# EasyEDA Pro project 2.8_pcb_src.eprj, board PCB4
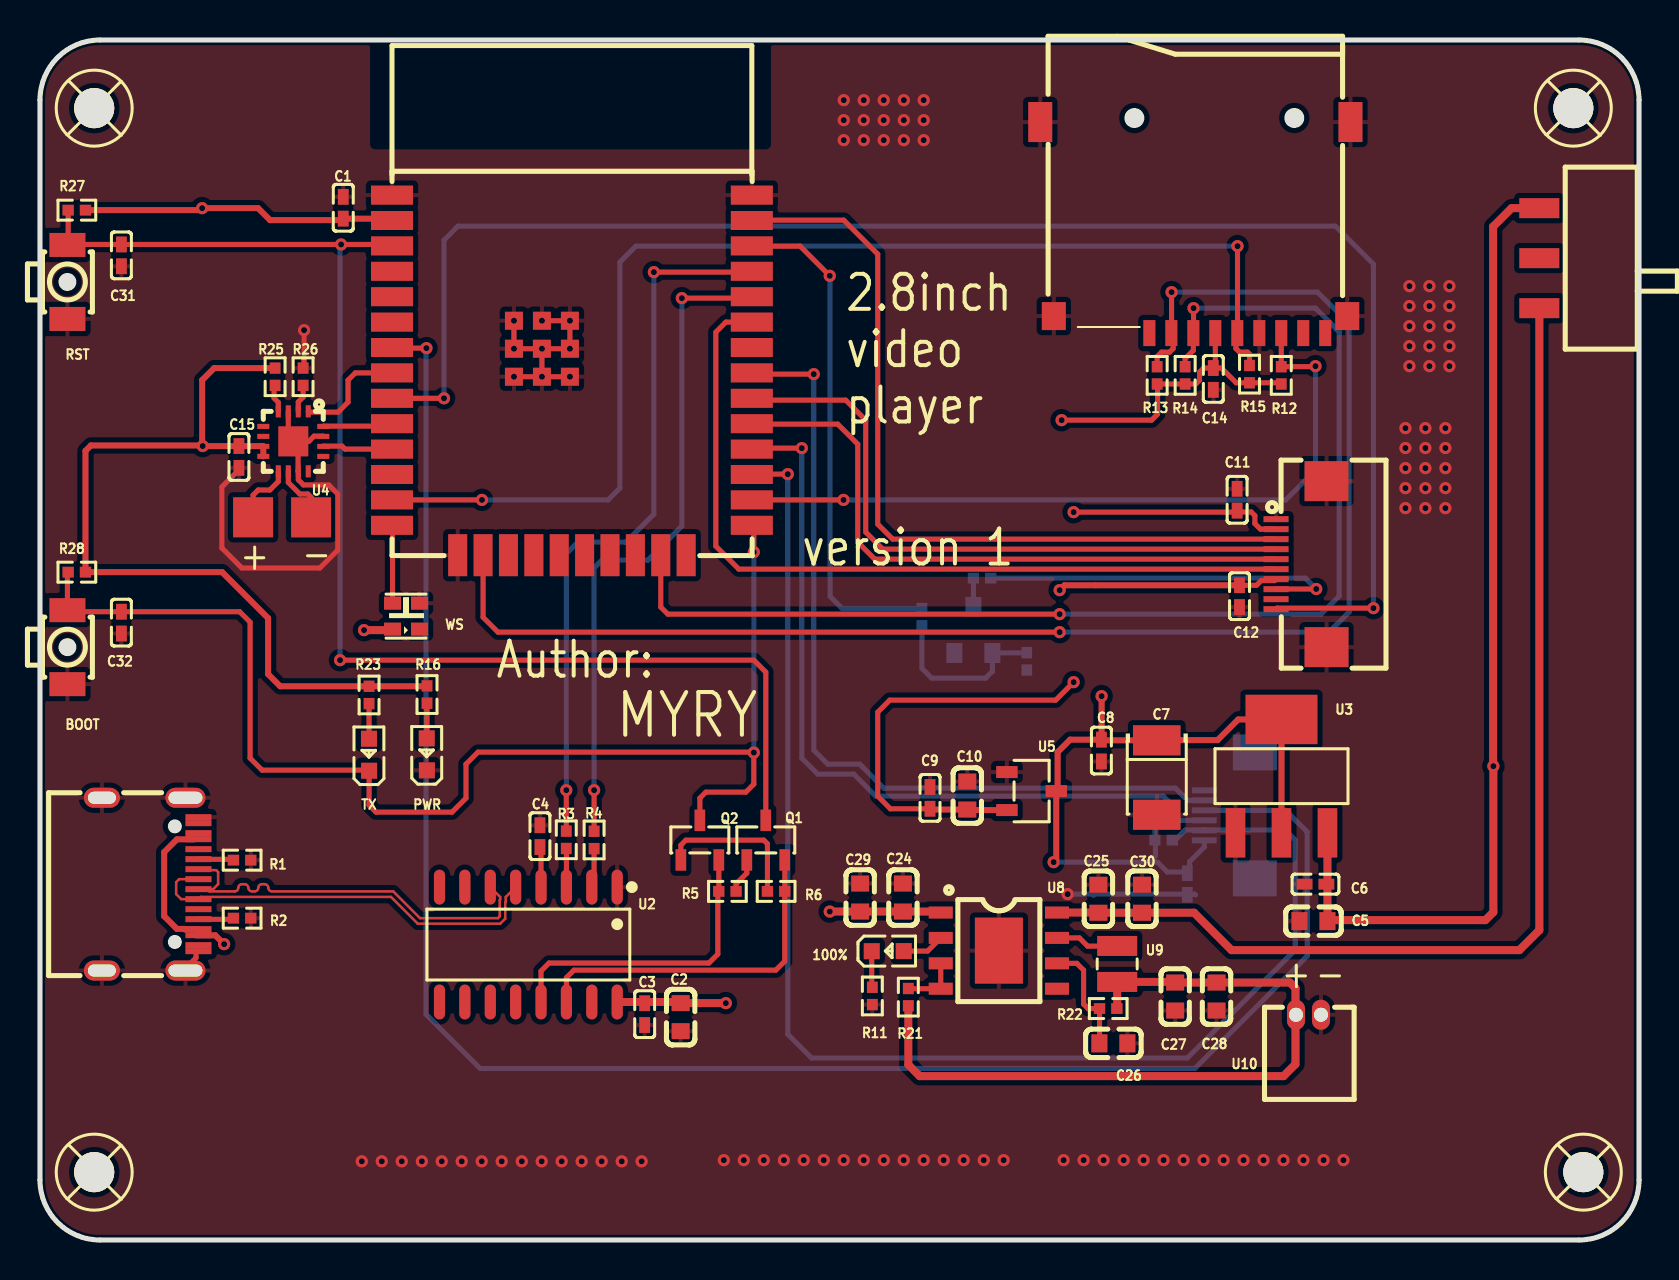
[diagram p4: board, top side]
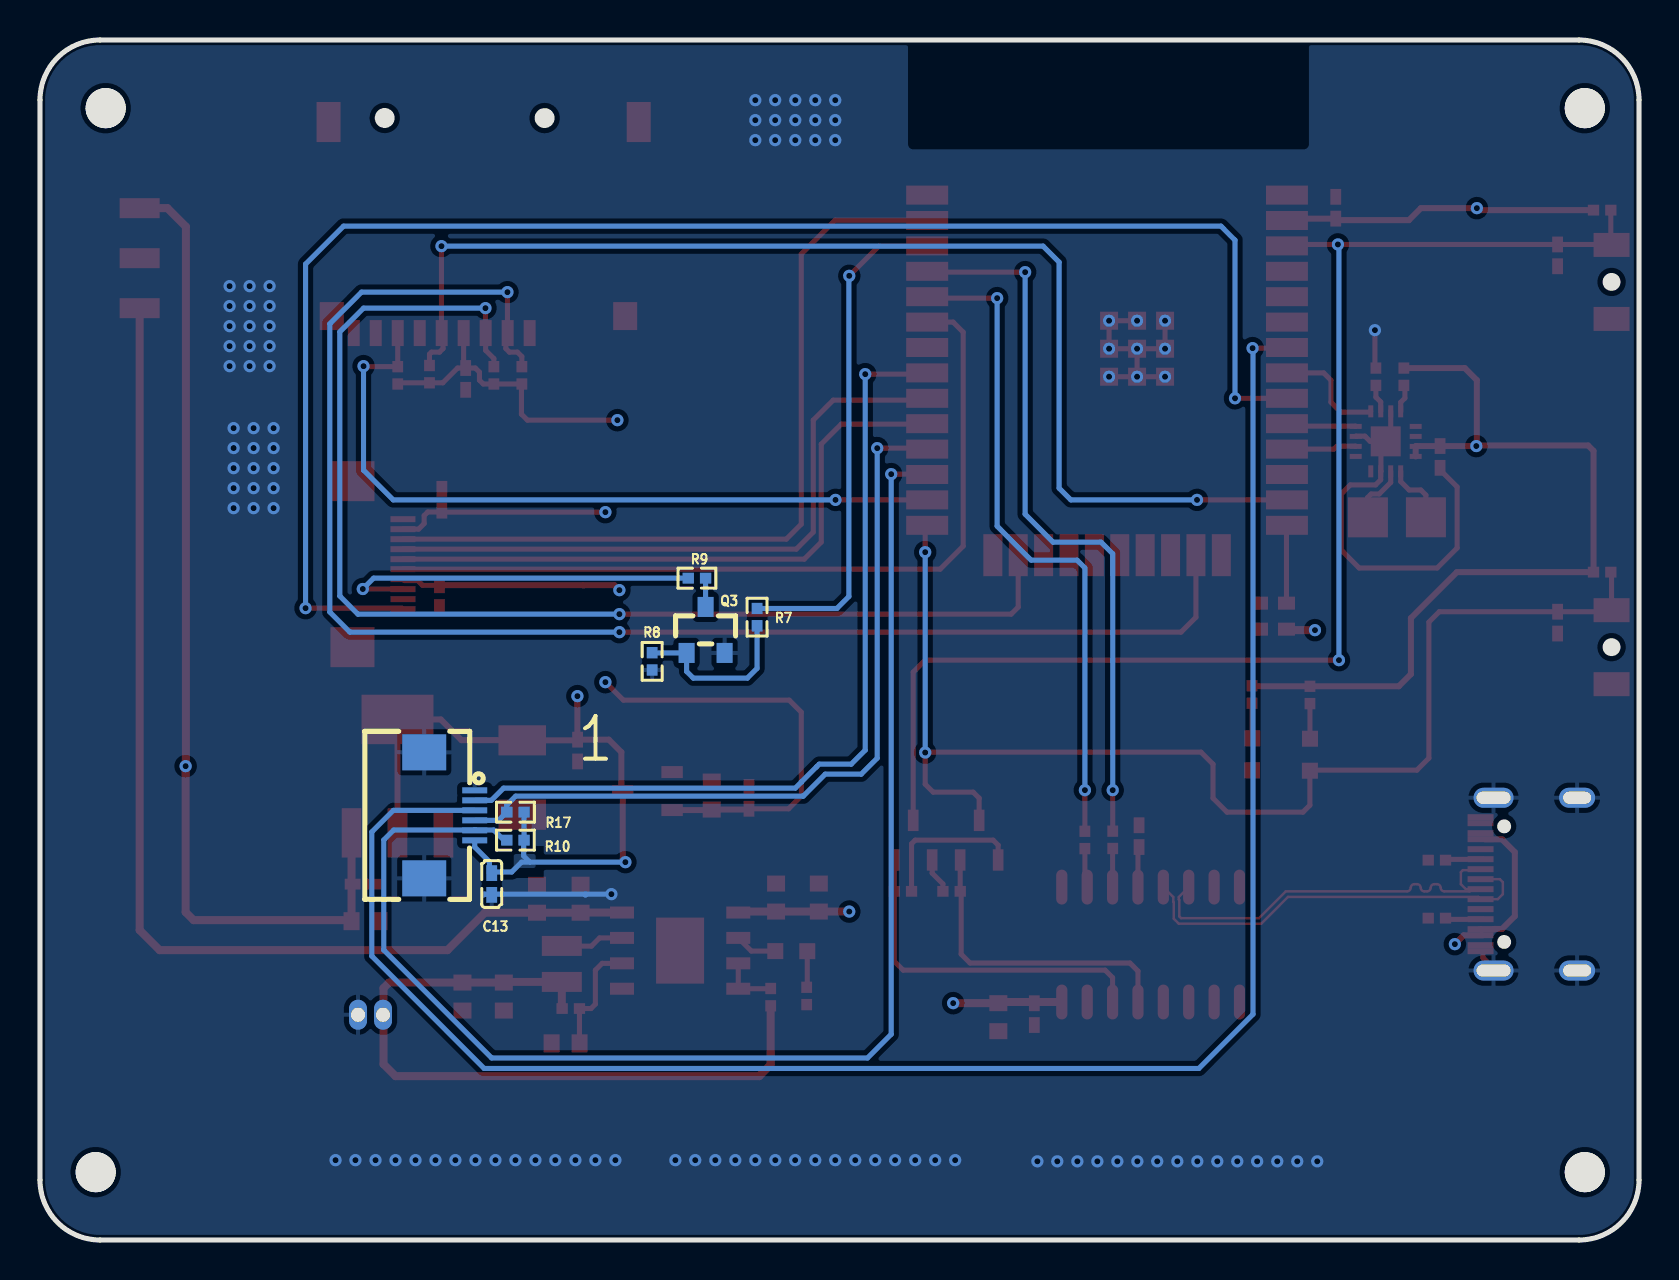
[diagram p5: board, bottom side, seen from below]

Outline 80 x 60 mm; copper layers: Top Layer, GND, PWR, Bottom Layer. Coordinates in mm from the lower left corner of the outline.
Outline path: 0,57 0,3 arc(0.88,0.88) 3,0 77,0 arc(79.12,0.88) 80,3 80,57 arc(79.12,59.12) 77,60 3,60 arc(0.88,59.12) 0,57
Stack: Top Layer 0.035mm 外层铜厚1oz / Dielectric1 0.2104mm 7628 RC49% 8.6mil / GND 0.0152mm 内层铜厚 / Dielectric2 1.065mm 1.1mm H/HOZ Copper / PWR 0.0152mm 内层铜厚 / Dielectric3 0.2104mm 7628 RC49% 8.6mil / Bottom Layer 0.035mm 外层铜厚1oz

## Design rules (mm)
net USB_DP: DP1
net USB_DN: DP1
template: 自定义配置
spacing copperThickness1oz (default): track to track 0.102, other pairs 0.152 to 0.3
spacing copperThickness2oz: track to track 0.203, other pairs 0.152 to 0.3
track width copperThickness1oz (default): min 0.127, default 0.254, max 2.54
track width copperThickness2oz: min 0.203, default 0.254, max 2.54
differential pair differentialPair (default): width min 0.124, default 0.254, max 2.54; gap min 0.152, default 0.152
via viaSize (default): diameter min 0.5, default 0.61, max 10; hole min 0.3, default 0.305, max 6.3

## Placement (name value [footprint] x y rotation side)
100%  XL-1608SURC-06  [LED0603-RD_RED]  42.41 14.44 0 top
BOOT  TS-1063S-B3D4  [KEY-SMD_L3.0-W2.5-LS4.0_TS-1603S]  1.37 29.64 270 top
C1  100nF  [C0402]  15.17 51.61 270 top
C2  10uF  [C0603]  32.05 11.14 90 top
C3  100nF  [C0402]  30.25 11.29 270 top
C4  100nF  [C0402]  25.01 20.19 270 top
C5  10uF  [C0603]  63.71 15.94 0 top
C6  100nF  [C0402]  63.81 17.79 180 top
C7  100uF  [CASE-B_3528]  55.87 23.12 270 top
C8  100nF  [C0402]  53.1 24.47 90 top
C9  100nF  [C0402]  44.53 22.11 270 top
C10  47uF  [C0603]  46.39 22.22 270 top
C11  100nF  [C0402]  59.89 37.01 90 top
C12  100nF  [C0402]  60.01 32.19 270 top
C13  100nF  [C0402]  57.4 17.8 270 bottom
C14  100nF  [C0402]  58.7 43.05 270 top
C15  100nF  [C0402]  9.95 39.15 270 top
C24  10uF  [C0603]  43.17 17.12 90 top
C25  10uF  [C0603]  52.95 17.06 90 top
C26  22uF  [C0603]  53.7 9.83 180 top
C27  22uF  [C0603]  56.79 12.17 270 top
C28  22uF  [C0603]  58.86 12.17 270 top
C29  22uF  [C0603]  41.03 17.12 270 top
C30  22uF  [C0603]  55.13 17.06 270 top
C31  100nF  [C0402]  4.07 49.23 90 top
C32  100nF  [C0402]  4.07 30.87 90 top
CARD1  TF-01A  [TF-SMD_TF-01A]  57.8 50.62 180 top
FPC1  0.5K-DX-10PWBG  [FPC-SMD_10P-P0.50_HDGC_0.5K-DX-10PWBG]  63.1 33.79 90 top
FPC2  0.5K-DX-6PWBG  [FPC-SMD_6P-P0.50_DEALON_0.5K-DX-6PWB]  59.51 21.23 270 bottom
PWR  XL-1608SURC-06  [LED0603-RD_RED]  19.35 24.28 90 top
Q1  S8050  [SOT-23-3_L2.9-W1.3-P1.90-LS2.3-BR]  36.31 19.99 270 top
Q2  S8050  [SOT-23-3_L2.9-W1.3-P1.90-LS2.3-BR]  33.01 19.99 270 top
Q3  Si2302CDS-T1-GE3  [SOT-23_L2.9-W1.3-P1.90-LS2.4-BR]  46.7 30.5 270 bottom
R1  5.1K  [R0402]  10.11 18.99 180 top
R2  5.1K  [R0402]  10.11 16.09 0 top
R3  5.1K  [R0402]  26.33 20.01 90 top
R4  5.1K  [R0402]  27.72 20 90 top
R5  12K  [R0402]  34.39 17.43 0 top
R6  12K  [R0402]  36.83 17.43 180 top
R7  1K  [R0402]  44.12 31.14 270 bottom
R8  10K  [R0402]  49.37 28.93 270 bottom
R9  10  [R0402]  47.13 33.09 0 bottom
R10  4.7K  [R0402]  56.21 19.99 0 bottom
R11  2K  [R0402]  41.64 12.2 90 top
R12  10K  [R0402]  62.1 43.23 270 top
R13  10K  [R0402]  55.89 43.23 270 top
R14  10K  [R0402]  57.29 43.23 270 top
R15  10K  [R0402]  60.51 43.29 270 top
R16  470  [R0402]  19.36 27.27 270 top
R17  4.7K  [R0402]  56.21 21.39 0 bottom
R21  1K  [R0402]  43.44 12.14 90 top
R22  1K  [R0402]  53.44 11.57 0 top
R23  470  [R0402]  16.46 27.25 270 top
R25  1M  [R0402]  11.76 43.16 90 top
R26  220  [R0402]  13.16 43.16 90 top
R27  10K  [R0402]  1.84 51.49 0 top
R28  10K  [R0402]  1.84 33.39 0 top
RST  TS-1063S-B3D4  [KEY-SMD_L3.0-W2.5-LS4.0_TS-1603S]  1.37 47.9 270 top
SCREW1  -  [Screw-Hole-M2]  2.71 56.59 0 top
SCREW2  -  [Screw-Hole-M2]  76.71 56.59 0 top
SCREW3  -  [Screw-Hole-M2]  77.21 3.39 0 top
SCREW4  -  [Screw-Hole-M2]  2.71 3.39 0 top
SW3  SK-3245S-L1-A  [SW-SMD_SK-3245S-L1-A-1]  75.01 49.09 270 top
TP1  -  [Test-Point-0.5mm]  13.56 36.13 180 top
TP2  -  [Test-Point-0.5mm]  10.66 36.14 180 top
TX  XL-1608SURC-06  [LED0603-RD_RED]  16.46 24.26 90 top
U2  CH340C  [SOP-16_L10.0-W3.9-P1.27-LS6.0-BL]  24.43 14.77 180 top
U3  AMS1117-3.3  [SOT-223-4_L6.5-W3.5-P2.30-LS7.0-BR]  62.11 23.19 270 top
U4  MAX98357AETE+T  [TQFN-16_L3.0-W3.0-P0.50-BL-EP1.5]  12.67 39.93 180 top
U5  XC6206-2.8V  [SOT-23-3_L2.9-W1.6-P1.90-LS2.8-BR]  49.61 22.45 180 top
U8  IP5306  [ESOP-8_L4.9-W3.9-P1.27-LS6.0-BL-EP]  47.97 14.47 270 top
U9  1uH  [IND-SMD_L2.5-W2.0_YXNAQ252010-3R3M]  53.89 13.8 90 top
U10  ZX-MX1.25-2PWZ  [CONN-TH_2P-P1.25_ZX-MX1.25-2PWZ]  63.46 11.26 0 top
U11  ESP32-WROOM-32E-N16  [WIFI-SMD_ESP32-WROOM-32E]  26.61 43.24 270 top
USB1  KH-TYPE-C-16P  [USB-C-SMD_KH-TYPE-C-16P]  5.51 17.79 270 top
WS  XL-2020RGBC-WS2812B  [LED-SMD_4P-L2.0-W2.0-BR-1]  18.31 31.19 0 top

## Footprints (pads in the part's own frame, mm; a bottom-side part is the same pattern mirrored in y, then rotated)
C0402
  rect 0.79x0.54 smd: 1(-0.545,0) 2(0.545,0)
C0603
  rect 0.8x0.9 smd: 1(-0.7,0) 2(0.7,0)
CASE-B_3528
  rect 1.506x2.376 smd: 1(-1.861,0) 2(1.861,0)
CONN-TH_2P-P1.25_ZX-MX1.25-2PWZ
  oval 0.9x1.5 hole 0.7: 1(-0.625,0) 2(0.625,0)
ESOP-8_L4.9-W3.9-P1.27-LS6.0-BL-EP
  rect 0.6x1.2 smd: 1(-1.905,-2.909) 2(-0.635,-2.909) 3(0.635,-2.909) 4(1.905,-2.909) 5(1.905,2.909) 6(0.635,2.909) 7(-0.635,2.909) 8(-1.905,2.909)
  rect 3.3x2.4 smd: 9(0,0)
FPC-SMD_6P-P0.50_DEALON_0.5K-DX-6PWB
  rect 0.3x1.25 smd: 1(-1.25,1.262) 2(-0.75,1.262) 3(-0.25,1.262) 4(0.25,1.262) 5(0.75,1.262) 6(1.25,1.262)
  rect 1.8x2.2 smd: 7(3.15,-1.262) 8(-3.15,-1.262)
FPC-SMD_10P-P0.50_HDGC_0.5K-DX-10PWBG
  rect 0.3x1.25 smd: 1(2.25,1.262) 2(1.75,1.262) 3(1.25,1.262) 4(0.75,1.262) 5(0.25,1.262) 6(-0.25,1.262) 7(-0.75,1.262) 8(-1.25,1.262) 9(-1.75,1.262) 10(-2.25,1.262)
  rect 2x2.2 smd: 11(-4.15,-1.262) 12(4.15,-1.262)
IND-SMD_L2.5-W2.0_YXNAQ252010-3R3M
  rect 1x2 smd: 1(0.9,0) 2(-0.9,0)
KEY-SMD_L3.0-W2.5-LS4.0_TS-1603S
  rect 1.2x1.8 smd: 1(-1.85,0) 2(1.85,0)
LED0603-RD_RED
  rect 0.8x0.8 smd: 1(-0.799,-0.004) 2(0.799,0.004)
LED-SMD_4P-L2.0-W2.0-BR-1
  rect 0.85x0.65 smd: 1(0.675,-0.65) 2(0.675,0.65) 3(-0.675,0.65) 4(-0.675,-0.65)
R0402
  rect 0.566x0.54 smd: 1(-0.433,0) 2(0.433,0)
Screw-Hole-M2
  round 2 hole 2: 1(0,0)
SOP-16_L10.0-W3.9-P1.27-LS6.0-BL
  oval 0.56x1.745 smd: 1(-4.445,-2.873) 2(-3.175,-2.873) 3(-1.905,-2.873) 4(-0.635,-2.873) 5(0.635,-2.873) 6(1.905,-2.873) 7(3.175,-2.873) 8(4.445,-2.873) 9(4.445,2.873) 10(3.175,2.873) 11(1.905,2.873) 12(0.635,2.873) 13(-0.635,2.873) 14(-1.905,2.873) 15(-3.175,2.873) 16(-4.445,2.873)
SOT-23-3_L2.9-W1.3-P1.90-LS2.3-BR
  rect 1.07x0.532 smd: 1(0.99,-0.95) 2(0.99,0.95) 3(-0.99,0)
SOT-23-3_L2.9-W1.6-P1.90-LS2.8-BR
  rect 1.07x0.6 smd: 1(1.235,-0.95) 2(1.235,0.95) 3(-1.235,0)
SOT-23_L2.9-W1.3-P1.90-LS2.4-BR
  rect 1x0.8 smd: 1(1.15,-0.95) 2(1.15,0.95) 3(-1.15,0)
SOT-223-4_L6.5-W3.5-P2.30-LS7.0-BR
  rect 2.47x0.98 smd: 1(2.835,-2.3) 2(2.835,0) 3(2.835,2.3)
  rect 2.47x3.6 smd: 4(-2.835,0)
SW-SMD_SK-3245S-L1-A-1
  rect 1x2 smd: 1(-2.5,0) 2(0,0) 3(2.5,0)
Test-Point-0.5mm
  rect 2x2 smd: 1(0,0)
TF-SMD_TF-01A
  rect 0.6x1.3 smd: 1(2.3,5.276) 2(1.2,5.276) 3(0.101,5.276) 4(-1,5.276) 5(-2.099,5.276) 6(-3.2,5.276) 7(-4.3,5.276) 8(-5.399,5.276) 9(-6.5,5.276)
  rect 1.2x1.4 smd: 10(-7.599,4.426) 13(7.08,4.426)
  rect 1.2x2 smd: 11(-7.76,-5.276) 12(7.76,-5.276)
TQFN-16_L3.0-W3.0-P0.50-BL-EP1.5
  rect 0.25x0.6 smd: 1(-0.749,-1.5) 2(-0.248,-1.5) 3(0.252,-1.5) 4(0.751,-1.5) 9(0.75,1.5) 10(0.25,1.5) 11(-0.25,1.5) 12(-0.749,1.5)
  rect 0.6x0.25 smd: 5(1.5,-0.748) 6(1.5,-0.248) 7(1.5,0.252) 8(1.5,0.752) 13(-1.5,0.752) 14(-1.5,0.252) 15(-1.5,-0.248) 16(-1.5,-0.748)
  rect 1.5x1.5 smd: 17(0,0)
USB-C-SMD_KH-TYPE-C-16P
  oval 1x2 hole 0.6x1.7: 1(-4.32,1.765) 2(4.32,1.765)
  oval 1x1.8 hole 0.6x1.4: 3(-4.32,-2.415) 4(4.32,-2.415)
  rect 0.3x1.3 smd: A1(-3.35,2.415) A4(-2.55,2.415) A5(-1.25,2.415) A6(-0.25,2.415) A7(0.25,2.415) A8(1.25,2.415) A9(2.55,2.415) A12(3.35,2.415) B1(3.05,2.415) B4(2.25,2.415) B5(1.75,2.415) B6(0.75,2.415) B7(-0.75,2.415) B8(-1.75,2.415) B9(-2.25,2.415) B12(-3.05,2.415)
WIFI-SMD_ESP32-WROOM-32E
  rect 0.95x2.1 smd: 1(-9.002,-9) 2(-7.732,-9) 3(-6.463,-9) 4(-5.192,-9) 5(-3.922,-9) 6(-2.652,-9) 7(-1.383,-9) 8(-0.113,-9) 9(1.157,-9) 10(2.428,-9) 11(3.697,-9) 12(4.968,-9) 13(6.237,-9) 14(7.508,-9) 25(7.508,9) 26(6.237,9) 27(4.968,9) 28(3.697,9) 29(2.428,9) 30(1.157,9) 31(-0.113,9) 32(-1.383,9) 33(-2.652,9) 34(-3.922,9) 35(-5.192,9) 36(-6.463,9) 37(-7.732,9) 38(-9.002,9)
  rect 2.1x0.95 smd: 15(9.002,-5.715) 16(9.002,-4.445) 17(9.002,-3.175) 18(9.002,-1.905) 19(9.002,-0.635) 20(9.002,0.635) 21(9.002,1.905) 22(9.002,3.175) 23(9.002,4.445) 24(9.002,5.715)
  rect 0.9x0.9 smd: 39(-2.721,-0.1) 39(-2.721,-1.5) 39(-2.721,-2.9) 39(-1.321,-0.1) 39(-1.321,-1.5) 39(-1.321,-2.9) 39(0.079,-0.1) 39(0.079,-1.5) 39(0.079,-2.9)

## Nets
As in the schematic, except:
5V: C2.2 C3.1 C5.2 C6.1 SW3.1 U2.16 U3.3 WS.4
GND: BOOT.2 C1.1 C2.1 C3.2 C4.1 C5.1 C6.2 C7.2 C8.1 C9.1 C10.1 C11.2 C12.2 C13.2 C14.2 C15.2 C24.2 C25.2 C26.1 C27.2 C28.2 C29.1 C30.1 C31.1 C32.1 CARD1.6 CARD1.10 CARD1.11 CARD1.12 CARD1.13 FPC1.1 FPC1.11 FPC1.12 FPC2.1 FPC2.7 FPC2.8 PWR.1 Q3.2 R1.1 R2.2 R8.2 R11.1 R26.2 RST.2 U2.1 U3.1 U4.3 U4.11 U4.15 U4.17 U5.1 U8.9 U10.2 U11.1 U11.15 U11.38 U11.39 USB1.1 USB1.2 USB1.3 USB1.4 USB1.A1 USB1.A12 USB1.B1 USB1.B12 WS.2
EN: C31.2 Q1.3 R27.1 RST.1 U11.3
IO0: BOOT.1 C32.2 Q2.3 R28.1 TX.1 U11.25
IO12_WS: U11.14 WS.3
$1N3729: 100%.2 U8.2
$1N3730: 100%.1 R11.2
$1N3861: R23.2 TX.2
$1N3865: PWR.2 R16.2

Pads without a net: CARD1 1 8 9; FPC1 9; SCREW1 1; SCREW2 1; SCREW3 1; SCREW4 1; SW3 2; U2 7 8 9 10 11 12 15; U4 5 6 12 13; U8 5; U11 4 5 6 12 17 18 19 20 21 22 24 32; USB1 A8 B8; WS 1

## Via types
v1: diameter 0.61, hole 0.305, Top Layer to Bottom Layer, 138 vias

## Routing (per net, layer and track width the routed paths; a pad name or vN(x,y) marks a point on that pad's centre or on a via; arc(x,y) is an arc through that point)
2.8V: length 40.6
  Top Layer w0.254: C9.2 42.55,21.56 41.91,22.19 41.91,26.39 42.51,26.99 50.81,26.99 v1(51.71,27.89) ; v1(51.71,36.39) 59.82,36.39 C11.1 59.96,36.4 60.6,36.4 60.78,36.22 60.78,35.82 61.06,35.54 FPC1.2
  Top Layer w0.3: C9.2 44.57,21.52 C10.2 46.42,21.5 U5.2
  PWR w0.254: v1(51.71,27.89) v1(51.71,36.39)
3V3: length 203.7
  Top Layer w0.254: C14.1 58.8,43.7 CARD1.4 ; C14.1 58.22,43.6 58.01,43.39 58.01,42.99 57.82,42.8 R14.2 R13.2 55.91,42.78 55.91,41.29 55.61,40.99 v1(51.11,40.99) ; C14.1 59.11,43.6 59.85,42.86 R15.2 62.04,42.86 R12.2 ; C12.1 60.87,32.74 61.1,32.97 61.77,32.97 FPC1.7
  Top Layer w0.3: C8.2 53.14,24.98 C7.1 55.88,24.99 58.91,24.99 59.95,26.03 U3.4 U3.2 ; C8.2 53.11,25.03 v1(53.11,27.19) ; C8.2 51.54,25.02 50.91,24.39 50.91,22.52 U5.3 50.84,19.02 v1(50.71,18.89) ; v1(51.01,32.49) 51.26,32.74 C12.1 ; R27.2 8.01,51.49 v1(8.11,51.59) 10.91,51.59 11.51,50.99 15.1,50.99 C1.2 17.52,51.07 U11.2 ; R16.1 19.34,27.69 R23.1 12.02,27.69 11.41,28.29 11.41,31.09 9.11,33.39 R28.2 2.28,39.46 2.55,39.73 8.11,39.73 ; R25.2 8.72,43.6 8.11,42.99 8.11,39.73 ; 8.11,39.73 v1(8.14,39.7) C15.1 11.16,39.7 U4.7 U4.8
  PWR w0.3: v1(8.11,51.59) 8.14,51.56 v1(8.14,39.7) 8.14,36.16 9.01,35.29 49.41,35.29 49.79,35.67 49.79,40.47 50.31,40.99 v1(51.11,40.99) 51.01,40.89 v1(51.01,32.49) 50.71,32.49 50.31,32.09 50.31,27.59 50.71,27.19 v1(53.11,27.19)
  Bottom Layer w0.254: FPC2.6 58.25,19.65 57.51,18.91 57.51,18.34 57.45,18.4 56.4,18.4 55.91,18.89 55.49,18.89 ; 55.49,18.89 v1(50.71,18.89) ; 55.49,18.89 55.8,19.2 55.8,19.97 R10.1 R17.1
5V: length 174.3
  Top Layer w0.4: 32.05,11.74 32,11.79 ; v1(16.21,30.49) 17.59,30.49 WS.4 ; C2.2 v1(34.31,11.84) ; U3.3 64.41,17.85 C6.1 64.41,17.74 C5.2 64.46,15.99 72.31,15.99 72.71,16.39 v1(72.71,23.69) 72.7,23.71 72.7,50.67 73.62,51.59 SW3.1 ; 31.9,11.9 U2.16
  PWR w0.4: v1(34.31,11.84) 34.31,9.89 36.6,7.6 68.2,7.6 72.71,12.11 v1(72.71,23.69) 17.01,23.69 16.21,24.49 v1(16.21,30.49)
GND: length 42.1
  Top Layer w0.254: v1(25.11,43.16) v1(25.11,44.56) ; v1(25.11,43.16) v1(26.51,43.16) ; v1(25.11,43.16) v1(23.71,43.16) ; v1(25.11,44.56) v1(26.51,44.56) v1(26.51,45.96) v1(25.11,45.96) ; v1(25.11,44.56) v1(23.71,44.56) v1(23.71,45.96) ; U4.17 12.91,39.69 12.91,38.44 U4.11 12.92,38.01 13.18,37.75 14.45,37.75 14.9,37.3 14.9,34.5 14,33.6 10.1,33.6 9.1,34.6 9.1,37.65 9.95,38.51 C15.2 ; U4.17 12.42,40.18 U4.3 ; U4.17 13.45,39.93 13.71,40.19 14.16,40.19 U4.15 ; 7.16,13.46 7.81,14.11 7.81,14.43 ; R26.2 13.21,43.65 v1(13.21,45.49)
  Bottom Layer w0.254: v1(51.41,17.29) 52.67,17.29 52.71,17.25 52.76,17.29 57.77,17.29 57.81,17.25
  vias: v1(16.1,3.93) v1(17.1,3.93) v1(18.1,3.93) v1(19.1,3.93) v1(20.1,3.93) v1(21.1,3.93) v1(22.1,3.93) v1(23.1,3.93) v1(24.11,3.93) v1(25.1,3.93) v1(26.1,3.93) v1(27.1,3.93) v1(28.1,3.93) v1(29.11,3.93) v1(30.1,3.93) v1(34.21,3.99) v1(35.21,3.99) v1(36.21,3.99) v1(37.22,3.99) v1(38.21,3.99) v1(39.21,3.99) v1(40.21,56.99) v1(40.21,55.99) v1(40.21,54.99) v1(40.21,3.99) v1(41.21,56.99) v1(41.21,55.99) v1(41.21,54.99) v1(41.21,3.99) v1(42.21,56.99) v1(42.21,55.99) v1(42.21,54.99) v1(42.22,3.99) v1(43.22,56.99) v1(43.22,55.99) v1(43.22,54.99) v1(43.21,3.99) v1(44.21,56.99) v1(44.21,55.99) v1(44.21,54.99) v1(44.21,3.99) v1(45.21,3.99) v1(46.21,3.99) v1(47.22,3.99) v1(48.21,3.99) v1(51.21,3.99) v1(52.21,3.99) v1(53.21,3.99) v1(54.22,3.99) v1(55.21,3.99) v1(56.21,3.99) v1(57.21,3.99) v1(58.21,3.99) v1(59.22,3.99) v1(60.21,3.99) v1(61.21,3.99) v1(62.21,3.99) v1(63.21,3.99) v1(64.22,3.99) v1(65.21,3.99) v1(68.31,40.59) v1(68.31,39.6) v1(68.31,38.59) v1(68.31,37.59) v1(68.31,36.59) v1(68.51,47.69) v1(68.51,46.7) v1(68.51,45.69) v1(68.51,44.69) v1(68.51,43.69) v1(69.31,40.59) v1(69.31,39.6) v1(69.31,38.59) v1(69.31,37.59) v1(69.31,36.59) v1(69.51,47.69) v1(69.51,46.7) v1(69.51,45.69) v1(69.51,44.69) v1(69.51,43.69) v1(70.31,40.59) v1(70.31,39.6) v1(70.31,38.59) v1(70.31,37.59) v1(70.31,36.59) v1(70.51,47.69) v1(70.51,46.7) v1(70.51,45.69) v1(70.51,44.69) v1(70.51,43.69)
BAT: length 37
  Top Layer w0.4: R22.2 53.89,11.59 53.89,12.9 56.76,12.9 C27.1 C28.1 62.53,12.87 62.81,12.59 62.81,11.29 ; 62.81,11.29 62.81,8.79 62.21,8.19 44.01,8.19 43.44,8.76 R21.1 ; 62.81,11.29 U10.1
DTR: length 15.5
  Top Layer w0.254: U2.13 25.07,13.45 25.47,13.85 33.47,13.85 33.91,14.29 33.91,17.39 R5.1 33.96,17.44 Q2.2
EN: length 67.8
  Top Layer w0.254: v1(15.01,28.99) 35.71,28.99 36.31,28.39 36.31,20.98 ; U11.3 17.54,49.78 v1(15.06,49.78) C31.2 1.4,49.78 ; 1.4,49.78 RST.1 ; 1.4,49.78 1.41,49.79 R27.1
  Bottom Layer w0.254: v1(15.06,49.78) 15.01,49.73 v1(15.01,28.99)
IO0: length 64.8
  Top Layer w0.254: v1(35.71,34.39) 35.71,35.64 U11.25 ; 33.01,20.98 33.01,22.09 33.31,22.39 35.31,22.39 35.71,22.79 v1(35.71,24.37) ; R28.1 1.37,33.36 BOOT.1 1.45,31.41 C32.2 9.99,31.41 10.51,30.89 10.51,24.09 11.11,23.49 16.44,23.49 TX.1 16.47,21.74 16.81,21.39 20.61,21.39 21.31,22.09 21.31,23.79 21.91,24.39 35.71,24.39
  Bottom Layer w0.254: v1(35.71,24.37) v1(35.71,34.39)
IO4_SD_MISO: length 37.4
  Top Layer w0.254: U11.26 v1(40.2,37.01) ; v1(63.81,43.69) 63.79,43.67 R12.1 ; 62.1,43.67 CARD1.7
  Bottom Layer w0.254: v1(63.81,43.69) 63.81,38.49 62.33,37.01 v1(40.2,37.01)
IO5_LCD_CS: length 31.9
  Top Layer w0.254: U11.29 35.64,40.79 39.91,40.79 40.91,39.79 40.91,34.89 41.76,34.04 FPC1.5
IO12_WS: length 3.9
  Top Layer w0.254: U11.14 17.64,35.71 WS.3
IO13_SD_CS: length 75.4
  Top Layer w0.254: U11.16 22.17,31.14 22.91,30.39 v1(51.01,30.39) ; R13.1 55.89,44.17 56.11,44.39 56.51,44.39 56.69,44.57 56.69,45.26 CARD1.2 56.61,45.36 v1(56.61,47.39)
  Bottom Layer w0.254: v1(56.61,47.39) 63.91,47.39 65.5,45.81 65.5,31.4 64.49,30.39 v1(51.01,30.39)
IO14_SD_SCK: length 61
  Top Layer w0.254: 59.83,45.05 59.83,44.57 60.01,44.39 60.41,44.39 60.51,44.29 R15.1 ; 59.83,45.05 59.83,45.28 CARD1.5 ; 59.83,45.05 59.91,45.13 v1(59.91,49.69) ; U11.13 v1(22.11,37.01)
  Bottom Layer w0.254: v1(59.91,49.69) 29.81,49.69 29.01,48.89 29.01,37.59 28.43,37.01 v1(22.11,37.01)
IO15_SD_MOSI: length 61.1
  Top Layer w0.254: v1(51.01,31.29) 31.41,31.29 31.06,31.65 31.06,34.24 ; R14.1 57.29,44.07 57.7,44.48 CARD1.3 57.71,45.36 v1(57.71,46.59)
  Bottom Layer w0.254: v1(57.71,46.59) 63.81,46.59 65,45.41 65,32.2 64.09,31.29 v1(51.01,31.29)
IO16_TP_SCL: length 70
  Top Layer w0.254: U11.27 35.63,38.29 v1(37.41,38.29)
  Bottom Layer w0.254: R10.2 56.79,19.99 57.3,20.5 58.23,20.5 FPC2.5 58.27,20.5 62.3,20.5 62.8,20 62.8,14.5 57.4,9.1 38.6,9.1 37.41,10.29 v1(37.41,38.29)
IO17_TP_SDA: length 39.7
  Top Layer w0.254: U11.28 35.66,39.59 v1(38.11,39.59)
  Bottom Layer w0.254: v1(38.11,39.59) 38.11,24.09 38.91,23.29 40.71,23.29 41.81,22.19 56.2,22.19 56.65,21.75 R17.2 57.06,20.98 FPC2.4
IO18_LCD_SCK: length 32.6
  Top Layer w0.254: FPC1.4 42.16,34.54 41.31,35.39 41.31,40.99 40.31,41.99 35.71,41.99 U11.30
IO19_TP_RST: length 42.5
  Top Layer w0.254: v1(38.71,43.29) 35.68,43.29 U11.31
  Bottom Layer w0.254: FPC2.2 57.42,21.98 56.81,22.59 42.21,22.59 41.9,22.9 41.9,22.91 41.16,23.65 41.16,23.65 41.01,23.79 39.41,23.79 38.71,24.49 v1(38.71,43.29)
IO22_LCD_BLK: length 25.4
  Top Layer w0.254: v1(39.51,48.21) 38.03,49.69 35.63,49.69 U11.36
  Bottom Layer w0.254: v1(39.51,48.21) 39.51,48.09 39.53,48.08 39.53,32.18 40.13,31.58 R7.1
IO23_LCD_MOSI: length 40.7
  Top Layer w0.254: FPC1.3 42.66,35.04 41.91,35.79 41.91,49.29 40.21,50.99 35.63,50.99 U11.37
IO25_I2S_CLK: length 3.5
  Top Layer w0.254: U4.16 14.19,40.69 17.49,40.69 U11.10
IO26_I2S_LRCLK: length 3.5
  Top Layer w0.254: U11.11 15.26,39.55 15.11,39.69 14.19,39.69 U4.14
IO32_I2S_DIN: length 5.7
  Top Layer w0.254: U4.1 13.46,41.39 14.91,41.39 15.41,41.89 15.41,42.99 15.78,43.36 U11.8
IO32_LCD_RS: length 80.2
  Top Layer w0.254: U11.9 v1(20.21,42.09) ; FPC1.10 61.89,31.59 v1(66.71,31.59)
  Bottom Layer w0.254: v1(66.71,31.59) 66.71,48.79 64.81,50.69 20.91,50.69 20.21,49.99 v1(20.21,42.09)
IO33_LCD_RST: length 41.2
  Top Layer w0.254: U11.33 34.32,45.9 33.81,45.39 33.81,34.69 34.96,33.54 FPC1.6
IO35_TP_INT: length 94.4
  Top Layer w0.254: v1(19.33,44.59) 17.65,44.59 U11.7
  Bottom Layer w0.254: FPC2.3 62.32,21.48 63.4,20.4 63.4,14.2 57.78,8.58 22.02,8.58 19.31,11.29 19.31,44.47 19.33,44.49 v1(19.33,44.59)
LEDK: length 18.5
  Top Layer w0.254: v1(63.85,32.55) 61.85,32.55 FPC1.8
  Bottom Layer w0.254: v1(63.85,32.55) 63.31,33.09 R9.2
RTS: length 17.5
  Top Layer w0.254: Q1.2 37.26,17.44 R6.1 37.26,13.94 36.81,13.49 26.71,13.49 26.34,13.12 26.34,11.9
RX0: length 33.4
  Top Layer w0.254: R4.2 v1(27.72,22.49) ; v1(32.11,47.09) 35.54,47.09 U11.34
  Bottom Layer w0.254: v1(32.11,47.09) 32.11,35.69 30.41,33.99 28.11,33.99 27.72,33.6 v1(27.72,22.49)
TX0: length 36.1
  Top Layer w0.254: U11.35 35.57,48.39 v1(30.71,48.39) ; R3.2 v1(26.33,22.49)
  Bottom Layer w0.254: v1(30.71,48.39) 30.71,36.29 29.31,34.89 26.91,34.89 26.33,34.31 v1(26.33,22.49)
USB_5V: length 45.1
  Top Layer w0.3: USB1.B4 7.92,15.53 7.24,15.53 7.22,15.55 6.85,15.55 6.21,16.19 6.21,19.39 6.85,20.03 7.71,20.03 ; v1(9.21,14.79) 8.77,15.23 7.81,15.23
  Top Layer w0.4: v1(39.51,16.42) C29.2 C24.1 45.02,16.42 U8.1
  PWR w0.4: v1(9.21,14.79) 17.31,14.79 18.94,16.42 v1(39.51,16.42)
USB_DN: length 21
  Top Layer w0.124: USB1.B7 7.98,18.49 8.81,18.49 8.91,18.39 8.91,17.79 8.66,17.54 USB1.A7 7.98,17.5 8.41,17.5 8.47,17.43 9.74,17.43 arc(9.87,17.48) 9.92,17.61 arc(9.98,17.74) 10.1,17.79 10.24,17.79 arc(10.37,17.74) 10.42,17.61 arc(10.48,17.48) 10.6,17.43 10.74,17.43 arc(10.87,17.48) 10.92,17.61 arc(10.98,17.74) 11.1,17.79 11.24,17.79 arc(11.37,17.74) 11.42,17.61 arc(11.48,17.48) 11.6,17.43 17.67,17.43 19.01,16.09 22.91,16.09 23,16.18 23,17 23.02,17.02 23.02,17.15 U2.6
USB_DP: length 20.8
  Top Layer w0.124: 23.8,17.65 23.3,17.15 23.3,16.91 23.28,16.89 23.28,16.07 23.03,15.82 18.9,15.82 17.56,17.15 8.04,17.15 USB1.B6 7.06,17.04 6.81,17.29 6.81,17.89 6.96,18.04 USB1.A6
$1N3729: length 2.1
  Top Layer w0.254: 100%.2 44.41,14.45 U8.2
$1N3730: length 1.8
  Top Layer w0.254: R11.2 41.61,12.67 100%.1
$1N3732: length 2.9
  Top Layer w0.254: U8.3 U8.4 43.45,12.56 R21.2
$1N3735: length 56.4
  Top Layer w0.4: SW3.3 75.01,15.49 74.01,14.49 59.61,14.49 57.74,16.36 55.13,16.36 ; C30.2 C25.1 52.94,16.37 U8.8
$1N3738: length 3.2
  Top Layer w0.254: U8.7 52,15.1 52.41,14.69 53.88,14.69 U9.1
$1N3741: length 5.8
  Top Layer w0.254: U8.6 51.87,13.83 52.21,13.49 52.21,11.79 52.43,11.57 53.01,11.57 53.01,9.84 C26.2
$1N3751: length 2
  Top Layer w0.254: 7.81,19.03 9.82,19.03 9.83,19.04
$1N3752: length 2
  Top Layer w0.254: 7.81,16.03 9.83,16.03
$1N3763: length 2
  Top Layer w0.254: R4.1 27.72,17.76 U2.2
$1N3764: length 1.9
  Top Layer w0.254: 26.34,17.65 26.34,19.57 R3.1
$1N3773: length 2
  Top Layer w0.254: 24.96,19.64 25.07,19.53 U2.4
$1N3785: length 1.8
  Top Layer w0.254: Q1.1 35.36,18.34 34.83,17.81 R5.2
$1N3786: length 7.6
  Top Layer w0.254: R6.2 36.39,19.81 36.21,19.99 32.31,19.99 32.06,19.74 Q2.1
$1N3820: length 8.7
  Bottom Layer w0.254: R7.2 44.12,28.58 44.61,28.09 47.31,28.09 47.65,28.43 Q3.1 49.36,29.35 R8.1
$1N3822: length 1.4
  Bottom Layer w0.254: R9.1 46.7,31.66
$1N3854: length 3
  Top Layer w0.254: U4.10 12.42,37.88 13,37.3 13.4,37.3 13.58,37.12 13.58,36.15 TP1.1
$1N3855: length 3.2
  Top Layer w0.254: U4.9 11.92,37.92 11.5,37.5 10.92,37.5 10.66,37.25 TP2.1
$1N3861: length 1.8
  Top Layer w0.254: R23.2 16.46,25.07 TX.2
$1N3865: length 1.8
  Top Layer w0.254: R16.2 19.36,25.1 PWR.2
$1N3915: length 1.4
  Top Layer w0.254: U4.4 11.92,41.88 11.71,42.09 11.71,42.68 R25.1
$1N3916: length 1.4
  Top Layer w0.254: U4.2 12.92,41.9 13.16,42.14 R26.1

## Copper pours and planes (outline as drawn; the poured copper is in the pictures)
GND on Top Layer: -7.99,66.19 89.51,66.19 89.51,-5.91 -7.99,-5.91
GND on Bottom Layer: -9.79,69.79 87.71,69.79 87.71,-6.91 -9.79,-6.91
GND on GND: -19.09,63.39 103.21,63.39 103.21,-8.91 -19.09,-8.91
GND on PWR: -19.79,66.59 90.51,66.59 90.51,-2.41 -19.79,-2.41

Small or netless copper shapes (teardrops, artwork), in the pictures only: 1 on Bottom Layer

## Text on the board
Bottom Silkscreen Layer: 1
Top Silkscreen Layer: + | - | Author: | version 1 | 2.8inch / video / player | MYRY
